# Altium schematic sheet AFE #1.SchDoc
size A3; PageSetup: Record=PageOptions|CenterHorizontal=True|CenterVertical=True|PrintScale=0.70|XCorrection=1.00|YCorrection=1.00|PrintKind=0|BorderSize=5000000|LeftOffset=0|BottomOffset=0|Orientation=2|PaperLength=1000|PaperWidth=1000|Scale=100|PaperSource=7|PrintQuality=600|MediaType=1|DitherType=10|PrintScaleMode=1|PaperKind=Letter|PaperIndex=1
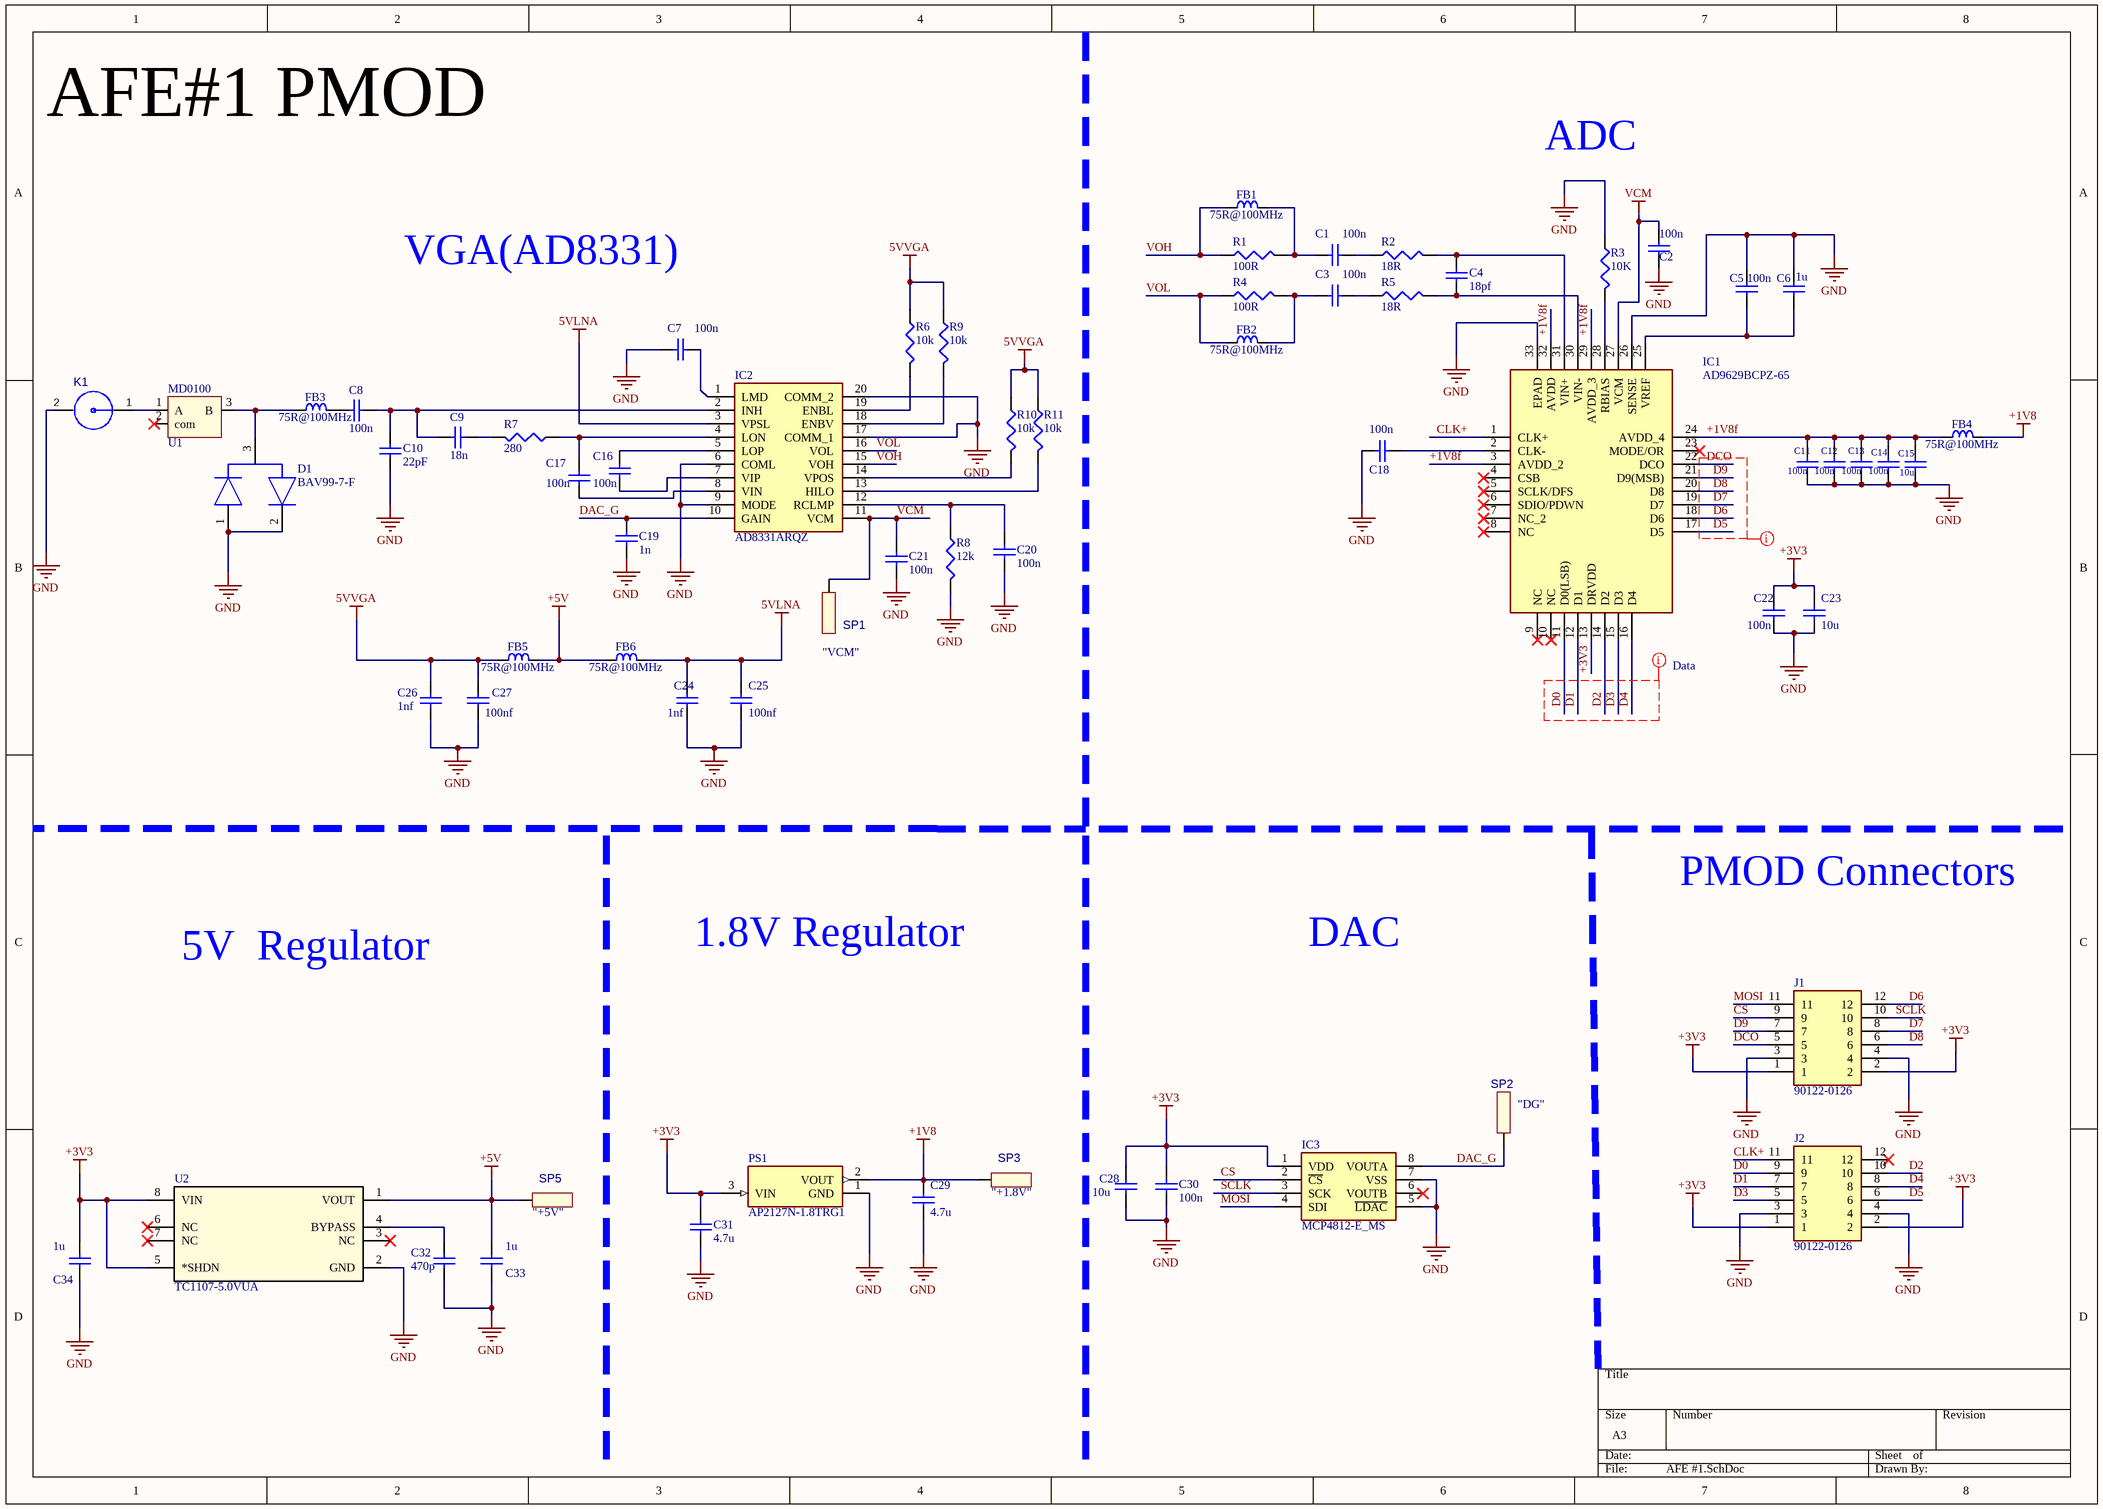
[diagram p0: AFE #1.SchDoc]

## Parts
C1  value 100n  [0402_C]  (hidden comment: cap0402)
C2  value 100n  [0402_C]  (hidden comment: cap0402)
C3  value 100n  [0402_C]  (hidden comment: cap0402)
C4  value 18pf  [0402_C]  (hidden comment: cap0402)
C5  value 100n  [0402_C]  (hidden comment: cap0402)
C6  value 1u  [SM0603 _3D_cap]  (hidden comment: cap0603)
C7  value 100n  [0402_C]  (hidden comment: cap0402)
C8  value 100n  [0402_C]  (hidden comment: cap0402)
C9  value 18n  [0402_C]  (hidden comment: cap0402)
C10  value 22pF  [0402_C]  (hidden comment: cap0402)
C11  value 100n  [0402_C]  (hidden comment: cap0402)
C12  value 100n  [0402_C]  (hidden comment: cap0402)
C13  value 100n  [0402_C]  (hidden comment: cap0402)
C14  value 100n  [0402_C]  (hidden comment: cap0402)
C15  value 10u  [SM0603 _3D_cap]  (hidden comment: cap0402)
C16  value 100n  [0402_C]  (hidden comment: cap0402)
C17  value 100n  [0402_C]  (hidden comment: cap0402)
C18  value 100n  [0402_C]  (hidden comment: cap0402)
C19  value 1n  [0402_C]  (hidden comment: cap0402)
C20  value 100n  [0402_C]  (hidden comment: cap0402)
C21  value 100n  [0402_C]  (hidden comment: cap0402)
C22  value 100n  [0402_C]  (hidden comment: cap0402)
C23  value 10u  [SM0603 _3D_cap]  (hidden comment: cap0603)
C24  value 1nf  [0402_C]  (hidden comment: cap0402)
C25  value 100nf  [0402_C]  (hidden comment: cap0402)
C26  value 1nf  [0402_C]  (hidden comment: cap0402)
C27  value 100nf  [0402_C]  (hidden comment: cap0402)
C28  value 10u  [SM0603 _3D_cap]  (hidden comment: cap0603)
C29  value 4.7u  [SM0603 _3D_cap]  (hidden comment: cap0603)
C30  value 100n  [0402_C]  (hidden comment: cap0402)
C31  value 4.7u  [SM0603 _3D_cap]  (hidden comment: cap0603)
C32  value 470p  [0402_C]  (hidden comment: cap0402)
C33  value 1u  [SM0603 _3D_cap]  (hidden comment: cap0603)
C34  value 1u  [SM0603 _3D_cap]  (hidden comment: cap0603)
D1  BAV99-7-F  [SOT95P240X120-3N]
FB1  75R@100MHz  [SM0603_3D_res]
FB2  75R@100MHz  [SM0603_3D_res]
FB3  75R@100MHz  [SM0603_3D_res]
FB4  75R@100MHz  [SM0603_3D_res]
FB5  75R@100MHz  [SM0603_3D_res]
FB6  75R@100MHz  [SM0603_3D_res]
IC1  AD9629BCPZ-65  [QFN50P500X500X100-33N]
IC2  AD8331ARQZ  [SOP64P600X175-20N]
IC3  MCP4812-E_MS  [SOP65P490X110-8N]
J1  90122-0126  [HDRRA12W65P254_2X6_1516X250X615P]
J2  90122-0126  [HDRRA12W65P254_2X6_1516X250X615P]
K1  SMA_Edge  [AMPHENOL_132357-11]  (value not drawn)
PS1  AP2127N-1.8TRG1  [SOT89P240X110-3N]
R1  100R  [0402_R]
R2  18R  [0402_R]
R3  10K  [0402_R]
R4  100R  [0402_R]
R5  18R  [0402_R]
R6  10k  [0402_R]
R7  280  [0402_R]
R8  12k  [0402_R]
R9  10k  [0402_R]
R10  10k  [0402_R]
R11  10k  [0402_R]
SP1  value "VCM"  [SolderPad_D1mm _round]  (hidden comment: SolderPad D1mm_round)
SP2  value "DG"  [SolderPad_D1mm _round]  (hidden comment: SolderPad D1mm_round)
SP3  value "+1.8V"  [SolderPad_D1mm _round]  (hidden comment: SolderPad D1mm_round)
SP5  value "+5V"  [SolderPad_D1mm _round]  (hidden comment: SolderPad D1mm_round)
U1  T/R switch  [SOT89-150P409X160-3N]  (value not drawn)
U2  TC1107-5.0VUA  [MSOP8_MC_MCH_]

## Nets
5VLNA: C24.2 C25.2 FB6.2 IC2.3(VPSL)
5VVGA: C26.2 C27.2 FB5.1 R6.1 R9.1 R10.1 R11.1
+1V8: C29.1 FB4.2 PS1.2(VOUT) SP3.1
+3V3: C22.1 C23.1 C28.1 C30.1 C31.2 C34.1 IC1.13(DRVDD) IC3.1(VDD) J1.1 J1.2 J2.1 J2.2 PS1.3(VIN) U2.5(*SHDN) U2.8(VIN)
+5V: C33.1 FB5.2 FB6.1 SP5.1 U2.1(VOUT)
GND: C2.2 C5.1 C6.1 C7.1 C10.1 C11.2 C12.2 C13.2 C14.2 C15.2 C18.2 C19.1 C20.1 C21.2 C22.2 C23.2 C24.1 C25.1 C26.1 C27.1 C28.2 C29.2 C30.2 C31.1 C32.1 C33.2 C34.2 D1.1(ANODE) D1.2(CATHODE) IC1.26(SENSE) IC1.33(EPAD) IC2.6(COML) IC2.9(MODE) IC2.17(COMM_1) IC2.20(COMM_2) IC3.5(~{LDAC}) IC3.7(VSS) J1.3 J1.4 J2.3 J2.4 K1.2 PS1.1(GND) R3.1 R8.2 U2.2(GND)
VCM: C2.1 C21.1 IC1.27(VCM) IC2.11(VCM) SP1.1
+1V8f: C11.1 C12.1 C13.1 C14.1 C15.1 FB4.1 IC1.3(AVDD_2) IC1.24(AVDD_4) IC1.29(AVDD_3) IC1.32(AVDD)
CLK+: IC1.1(CLK+) J2.11
CS: IC3.2(~{CS}) J1.9
D0: IC1.11(D0(LSB)) J2.9
D1: IC1.12(D1) J2.7
D2: IC1.14(D2) J2.10
D3: IC1.15(D3) J2.5
D4: IC1.16(D4) J2.8
D5: IC1.17(D5) J2.6
D6: IC1.18(D6) J1.12
D7: IC1.19(D7) J1.8
D8: IC1.20(D8) J1.6
D9: IC1.21(D9(MSB)) J1.7
DAC_G: C19.2 IC2.10(GAIN) IC3.8(VOUTA) SP2.1
DCO: IC1.22(DCO) J1.5
MOSI: IC3.4(SDI) J1.11
SCLK: IC3.3(SCK) J1.10
VOH: FB1.1 IC2.15(VOH) R1.1
VOL: FB2.1 IC2.16(VOL) R4.1
NetC1_1: C1.1 R2.1
NetC1_2: C1.2 FB1.2 R1.2
NetC3_1: C3.1 R5.1
NetC3_2: C3.2 FB2.2 R4.2
NetC4_1: C4.1 IC1.31(VIN+) R2.2
NetC4_2: C4.2 IC1.30(VIN-) R5.2
NetC5_2: C5.2 C6.2 IC1.25(VREF)
NetC7_2: C7.2 IC2.1(LMD)
NetC8_1: C8.1 FB3.2
NetC8_2: C8.2 C9.2 C10.2 IC2.2(INH)
NetC9_1: C9.1 R7.2
NetC16_1: C16.1 IC2.7(VIP)
NetC16_2: C16.2 IC2.5(LOP)
NetC17_1: C17.1 IC2.8(VIN)
NetC17_2: C17.2 IC2.4(LON) R7.1
NetC18_1: C18.1 IC1.2(CLK-)
NetC20_2: C20.2 IC2.12(RCLMP) R8.1
NetC32_2: C32.2 U2.4(BYPASS)
NetD1_3: D1.3(A/K) FB3.1 U1.3(B)
NetIC1_28: IC1.28(RBIAS) R3.2
NetIC2_13: IC2.13(HILO) R11.2
NetIC2_14: IC2.14(VPOS) R10.2
NetIC2_18: IC2.18(ENBV) R9.2
NetIC2_19: IC2.19(ENBL) R6.2
NetK1_1: K1.1 U1.1(A)

Not connected (* = marked no-connect by the designer): IC1 4(CSB)* 5(SCLK/DFS)* 6(SDIO/PDWN)* 7(NC_2)* 8(NC)* 9(NC)* 10(NC)* 23(MODE/OR)*; IC3 6(VOUTB)*; J2 12*; U1 2(com)*; U2 3(NC)* 6(NC)* 7(NC)*

## Layout directives
net class Data; rule Matched Net Lengths [Tolerance = 20mil]: D0, D1, D2, D3, D4, D5, D6, D7, D8, D9, DCO

## Notes on the sheet
- AFE#1 PMOD
- ADC
- VGA(AD8331)
- (near U1) MD0100
- PMOD Connectors
- 5V  Regulator
- 1.8V Regulator
- DAC

## Library data of the parts
C1-C5 C7-C22 C25 C27 C30 C32 = cap0603: Capacitor  0402 inch; Published: 8-Jun-2000; LatestRevisionDate: 17-Jul-2002; LatestRevisionNote: Re-released for DXP Platform.; PackageReference: RAD-0.3; Publisher: Altium Limited; PackageDescription: Radial Cap, Thru-Hole; 2 Leads; 0.3 in Pin Spacing
C6 C23 C24 C26 C28 C29 C31 C33 C34 = cap0603: Capacitor  0603 inch; Published: 8-Jun-2000; LatestRevisionDate: 17-Jul-2002; LatestRevisionNote: Re-released for DXP Platform.; PackageReference: RAD-0.3; Publisher: Altium Limited; PackageDescription: Radial Cap, Thru-Hole; 2 Leads; 0.3 in Pin Spacing
D1 = BAV99-7-F: Diode; Manufacturer_Name: Diodes Inc.; Datasheet Link: https://www.diodes.com/assets/Datasheets/ds12007.pdf; Height: 1.2mm; Manufacturer_Part_Number: BAV99-7-F; Mouser Part Number: 621-BAV99-F; Mouser Price/Stock: https://www.mouser.co.uk/ProductDetail/Diodes-Incorporated/BAV99-7-F?qs=E9Ihi8A05%252BSTVRjo74hQDA%3D%3D; Arrow Part Number: BAV99-7-F; Arrow Price/Stock: https://www.arrow.com/en/products/bav99-7-f/diodes-incorporated?region=nac
FB1-FB6 = chip inductance 0603: Part Number: IND0805_MURATA_BLM21BB750SN1D; Part Description: SMD EMIFIL Suppression Chip Ferrite Bead; Manufacturer: MURATA; Manufacturer Part Number: BLM21BB750SN1D; Power: 700mA; Resistance: 0.16R; Tolerance: ±25%; Table: Inductors SMD; Component Kind: Standard; Component Type: Standard; Footprint: INDC2012X105N; Pin Count: 2; Value: 75R@100MHz; Status: None; Case: 0805; Mounted: Yes; Socket: No; SMD: Yes; ComponentHeight: 1.05mm; Author: S. Jafar; CreateDate: 12/21/2015; LatestRevisionDate: 12/21/2015
IC1 = AD9629BCPZ-65: Integrated Circuit; Manufacturer_Name: Analog Devices; Manufacturer_Part_Number: AD9629BCPZ-65; Mouser Part Number: 584-AD9629BCPZ-65; Mouser Price/Stock: https://www.mouser.co.uk/ProductDetail/Analog-Devices/AD9629BCPZ-65?qs=BpaRKvA4VqGjvk9AFyB3jg%3D%3D; Arrow Part Number: AD9629BCPZ-65; Arrow Price/Stock: https://www.arrow.com/en/products/ad9629bcpz-65/analog-devices
IC2 = AD8331ARQZ: Integrated Circuit; Manufacturer_Name: Analog Devices; Datasheet Link: http://www.analog.com/static/imported-files/data_sheets/AD8331_8332_8334.pdf; Height: 1.75mm; Manufacturer_Part_Number: AD8331ARQZ; Mouser Part Number: 584-AD8331ARQZ; Mouser Price/Stock: https://www.mouser.co.uk/ProductDetail/Analog-Devices/AD8331ARQZ?qs=%2FtpEQrCGXCwx0%2F22gf7ohQ%3D%3D; Arrow Part Number: AD8331ARQZ; Arrow Price/Stock: https://www.arrow.com/en/products/ad8331arqz/analog-devices
IC3 = MCP4812-E_MS: Integrated Circuit; Manufacturer_Name: Microchip; Manufacturer_Part_Number: MCP4812-E/MS; Datasheet Link: http://ww1.microchip.com/downloads/en/DeviceDoc/20002249B.pdf; Height: 1.1mm; Mouser Part Number: 579-MCP4812-E/MS; Mouser Price/Stock: https://www.mouser.co.uk/ProductDetail/Microchip-Technology/MCP4812-E-MS?qs=bxUt0k7cytJEpyWPtzKy6A%3D%3D; Arrow Part Number: MCP4812-E/MS; Arrow Price/Stock: https://www.arrow.com/en/products/mcp4812-ems/microchip-technology
J1 J2 = 90122-0126: Connector; Manufacturer_Name: Molex; Datasheet Link: https://componentsearchengine.com/Datasheets/2/90122-0126.pdf; Height: 6.15mm; Manufacturer_Part_Number: 90122-0126; Mouser Part Number: 538-90122-0126; Mouser Price/Stock: https://www.mouser.co.uk/ProductDetail/Molex/90122-0126?qs=PvP5v7Eimsm0iCqn6boA0w%3D%3D
PS1 = AP2127N-3.3TRG1: Power Supply; Manufacturer_Name: Diodes Inc.; Datasheet Link: https://componentsearchengine.com/Datasheets/1/AP2127N-3.3TRG1.pdf; Height: 1.1mm; Manufacturer_Part_Number: AP2127N-3.3TRG1; Mouser Part Number: 621-AP2127N-3.3TRG1; Mouser Price/Stock: https://www.mouser.co.uk/ProductDetail/Diodes-Incorporated/AP2127N-33TRG1/?qs=x6A8l6qLYDCwIat%252BGHxAAg%3D%3D; Arrow Part Number: AP2127N-3.3TRG1; Arrow Price/Stock: https://www.arrow.com/en/products/ap2127n-3.3trg1/diodes-incorporated
R1 R3 R4 = RC0402FR-0710KL: RES 10K OHM 1/16W 0402 SMD; Power (Watts): 0.063W, 1/16W; .Checked PCB: used; Category: Resistors; Package / Case: 0402 (1005 Metric); Value: 10k; .Checked SCH: used; Size / Dimension: 0.039" L x 0.020" W (1.00mm x 0.50mm); Height: 0.016" (0.40mm); ComponentLink1URL: http://www.yageo.com/documents/recent/PYu-RC0402_51_RoHS_L_6.pdf; ComponentLink1Description: http://www.yageo.com/documents/recent/PYu-RC0402_51_RoHS_L_6.pdf
R2 R5 = RC0402FR-0710KL: RES 18 OHM 1/16W 0402 SMD; Power (Watts): 0.063W, 1/16W; .Checked PCB: used; Category: Resistors; Package / Case: 0402 (1005 Metric); Value: 18R; .Checked SCH: used; Size / Dimension: 0.039" L x 0.020" W (1.00mm x 0.50mm); Height: 0.016" (0.40mm); ComponentLink1URL: http://www.yageo.com/documents/recent/PYu-RC0402_51_RoHS_L_6.pdf; ComponentLink1Description: http://www.yageo.com/documents/recent/PYu-RC0402_51_RoHS_L_6.pdf
R6 R9-R11 = RC0402FR-0710KL: RES 10K OHM 1/16W 1% 0402 SMD; Resistance (Ohms): 280; Power (Watts): 0.063W, 1/16W; .Checked PCB: used; Category: Resistors; Package / Case: 0402 (1005 Metric); Value: 10k; .Checked SCH: used; Size / Dimension: 0.039" L x 0.020" W (1.00mm x 0.50mm); Height: 0.016" (0.40mm); ComponentLink1URL: http://www.yageo.com/documents/recent/PYu-RC0402_51_RoHS_L_6.pdf; ComponentLink1Description: http://www.yageo.com/documents/recent/PYu-RC0402_51_RoHS_L_6.pdf
R7 = RC0402FR-0710KL: RES 280 OHM 1/16W 0402 SMD; Power (Watts): 0.063W, 1/16W; .Checked PCB: used; Category: Resistors; Package / Case: 0402 (1005 Metric); Resistance (Ohms): 280; Value: 280; .Checked SCH: used; Size / Dimension: 0.039" L x 0.020" W (1.00mm x 0.50mm); Height: 0.016" (0.40mm); ComponentLink1URL: http://www.yageo.com/documents/recent/PYu-RC0402_51_RoHS_L_6.pdf; ComponentLink1Description: http://www.yageo.com/documents/recent/PYu-RC0402_51_RoHS_L_6.pdf
R8 = RC0402FR-0710KL: RES 12K OHM 1/16W 0402 SMD; Power (Watts): 0.063W, 1/16W; .Checked PCB: used; Category: Resistors; Package / Case: 0402 (1005 Metric); Value: 12k; .Checked SCH: used; Size / Dimension: 0.039" L x 0.020" W (1.00mm x 0.50mm); Height: 0.016" (0.40mm); ComponentLink1URL: http://www.yageo.com/documents/recent/PYu-RC0402_51_RoHS_L_6.pdf; ComponentLink1Description: http://www.yageo.com/documents/recent/PYu-RC0402_51_RoHS_L_6.pdf
SP1-SP3 SP5 = SolderPad D1mm_round: for finger touch
U1 = MD0100N8-G
U2 = TC1107-5.0VUA: No Description Available; Mfr_Name: Microchip; Copyright: Copyright (C) 2022 Ultra Librarian. All rights reserved.; Manufacturer_Part_Number: TC1107-5.0VUA; RefDes: RefDes; Type: DEV
K1 = SMA_Edge: Value: *